# EAGLE design RadioAdapterBoard (EAGLE 7.3.0)
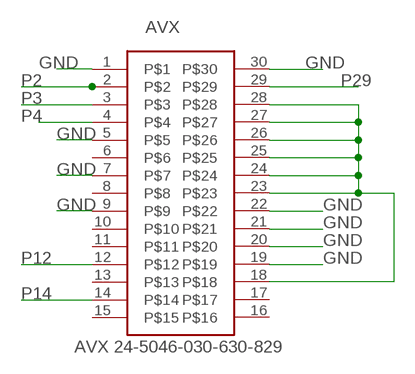
[diagram p0: schematic, sheet 1]

## Parts
AVX  AVX-24-5046-030-630-829  [AVX-24-5046-630-829]

## Nets
3V6: AVX.18 AVX.23 AVX.24 AVX.25 AVX.26 AVX.27 AVX.28
GND: AVX.1 AVX.5 AVX.7 AVX.9 AVX.19 AVX.20 AVX.21 AVX.22 AVX.30
P2: AVX.2
P3: AVX.3
P4: AVX.4
P12: AVX.12
P14: AVX.14
P29: AVX.29
Unconnected: AVX.6 AVX.8 AVX.10 AVX.11 AVX.13 AVX.15 AVX.16 AVX.17

## Library data of the parts
AVX = CNTRL_BOARD:AVX-24-5046-030-630-829

## Board
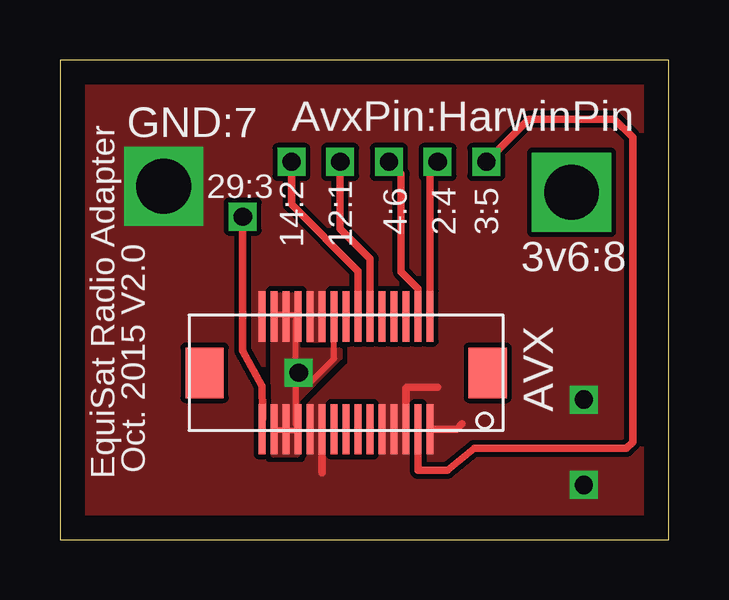
[diagram p1: board, top side]
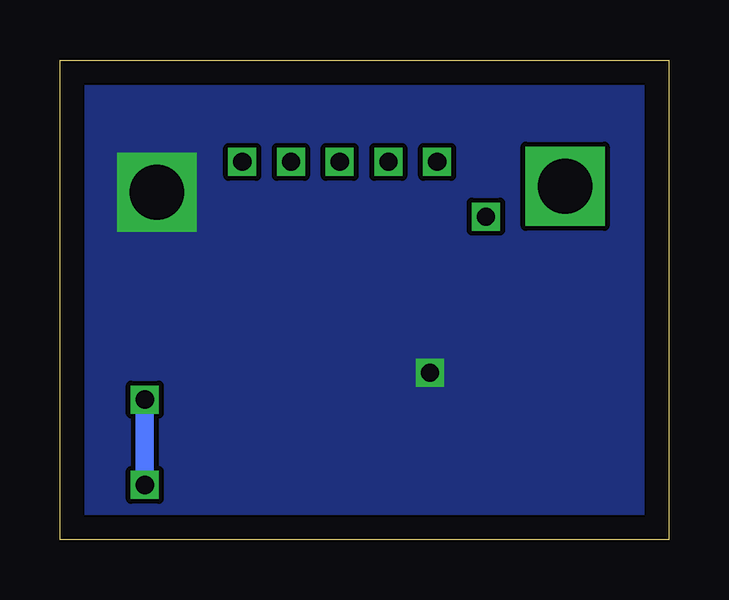
[diagram p2: board, bottom side, seen from below]

Size 25.38 x 19.99 mm. Coordinates in mm from the lower left corner, seen from the top.
Outline: 0,0 25.38,0 25.38,19.99 0,19.99 0,0
Copper layers (1*16): Top 0.035mm / dielectric 1.5mm / Bottom 0.035mm
Design rules "default": minimum track width 10mil, minimum drill 24mil, track to track 8mil, track to pad 8mil, pad to pad 8mil, via to via 8mil, smd to smd 8mil, copper to edge 40mil, drill to drill 8mil, minimum pad ring 10mil, minimum via ring 8mil, stop-mask expansion 4mil, vias tented up to drill 0mil, thermal gap 10mil

### Footprints (pad centres in the part's own frame; a part is rotated, then mirrored left to right if it is on the bottom)
AVX-24-5046-630-829 = smd 0.3 x 2.1: 1 7.05,1.05; 2 7.05,5.75; 3 6.55,1.05; 4 6.55,5.75; 5 6.05,1.05; 6 6.05,5.75; 7 5.55,1.05; 8 5.55,5.75; 9 5.05,1.05; 10 5.05,5.75; 11 4.55,1.05; 12 4.55,5.75; 13 4.05,1.05; 14 4.05,5.75; 15 3.55,1.05; 16 3.55,5.75; 17 3.05,1.05; 18 3.05,5.75; 19 2.55,1.05; 20 2.55,5.75; 21 2.05,1.05; 22 2.05,5.75; 23 1.55,1.05; 24 1.55,5.75; 25 1.05,1.05; 26 1.05,5.75; 27 0.55,1.05; 28 0.55,5.75; 29 0.05,1.05; 30 0.05,5.75 | smd 1.6 x 2.1: P$31 -2.35,3.4; P$32 9.45,3.4

### Placement (x,y rotation side)
AVX  8.38,3.56 0 top

### Tracks (layer width: path | path; a pad name or v marks a point on that pad's centre or on a via)
3V6  (via drill 0.76, 2.29)
  Top 0.254: 9.37,9.37 8.91,9.37 AVX.28 | 9.37,9.37 9.83,9.37 AVX.24 9.83,9.14 9.83,7.09 v9.96,6.96 | 9.37,9.37 AVX.26 | 9.37,4.57 8.91,4.57 AVX.27 | 9.37,4.57 9.83,4.57 AVX.23 9.83,4.8 9.83,6.86 v9.96,6.96 | 9.37,4.57 AVX.25 | v9.96,6.96 10.29,6.63 10.52,6.63 11.43,7.54 11.43,9.14 AVX.18
  other vias: 21.34,14.48
  pour Bottom (no thermals): -1.52,21.59 25.4,21.59 26.42,-1.02 -1.27,-1.02
  pour Top (no thermals): 8.89,3.56 9.91,3.56 9.91,5.84 10.41,6.35 11.68,7.62 11.68,7.87 9.91,7.87 9.91,10.16 8.89,10.16
GND  (via drill 0.76, 2.29)
  Top 0.305: AVX.19 10.93,2.8 10.92,2.79 | AVX.1 16.54,4.61 16.76,4.83 | AVX.5 14.43,6.3 14.48,6.35 15.75,6.35
  Bottom 0.762: v21.84,5.84 v21.84,2.29
  other vias: 4.32,14.73
  pour Top (rank 2, no thermals): 26.16,20.83 25.91,-0.76 -1.27,-1.02 -0.76,20.83
P2  (via drill 0.76)
  Top 0.305: AVX.2 15.43,15.43 v15.75,15.75
P3  (via drill 0.76)
  Top 0.305: AVX.3 14.94,2.9 16.15,2.9 17.27,3.81 23.62,3.81 23.88,4.06 23.88,16.76 23.11,17.53 19.56,17.53 v17.78,15.75
P4  (via drill 0.76)
  Top 0.305: AVX.4 14.93,10.47 14.22,11.18 14.22,15.24 v13.72,15.75
P12  (via drill 0.76)
  Top 0.305: AVX.12 12.93,11.71 11.68,12.95 v11.68,15.75
P14  (via drill 0.76)
  Top 0.305: AVX.14 12.43,11.19 9.65,13.97 v9.65,15.75
P29  (via drill 0.76)
  Top 0.305: v7.62,13.46 7.62,7.87 8.43,6.4 8.44,5.33 AVX.29

### Text on the board
tPlace: GND:7 | AvxPin:HarwinPin | 29:3 | 4:6 | 2:4 | 3:5 | 14:2 | 12:1 | 3v6:8 | EquiSat Radio Adapter | Oct. 2015 V2.0